# EAGLE design extruderControllerv01 (EAGLE 9.2.2)
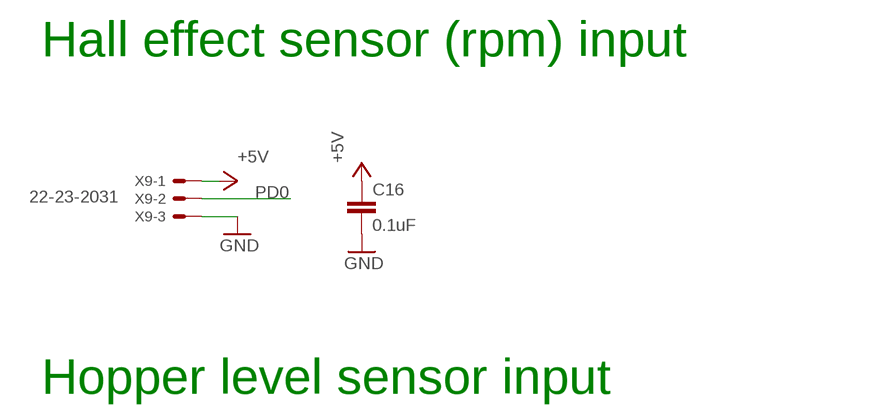
[diagram p0: schematic, sheet 1, part 1 of 3]
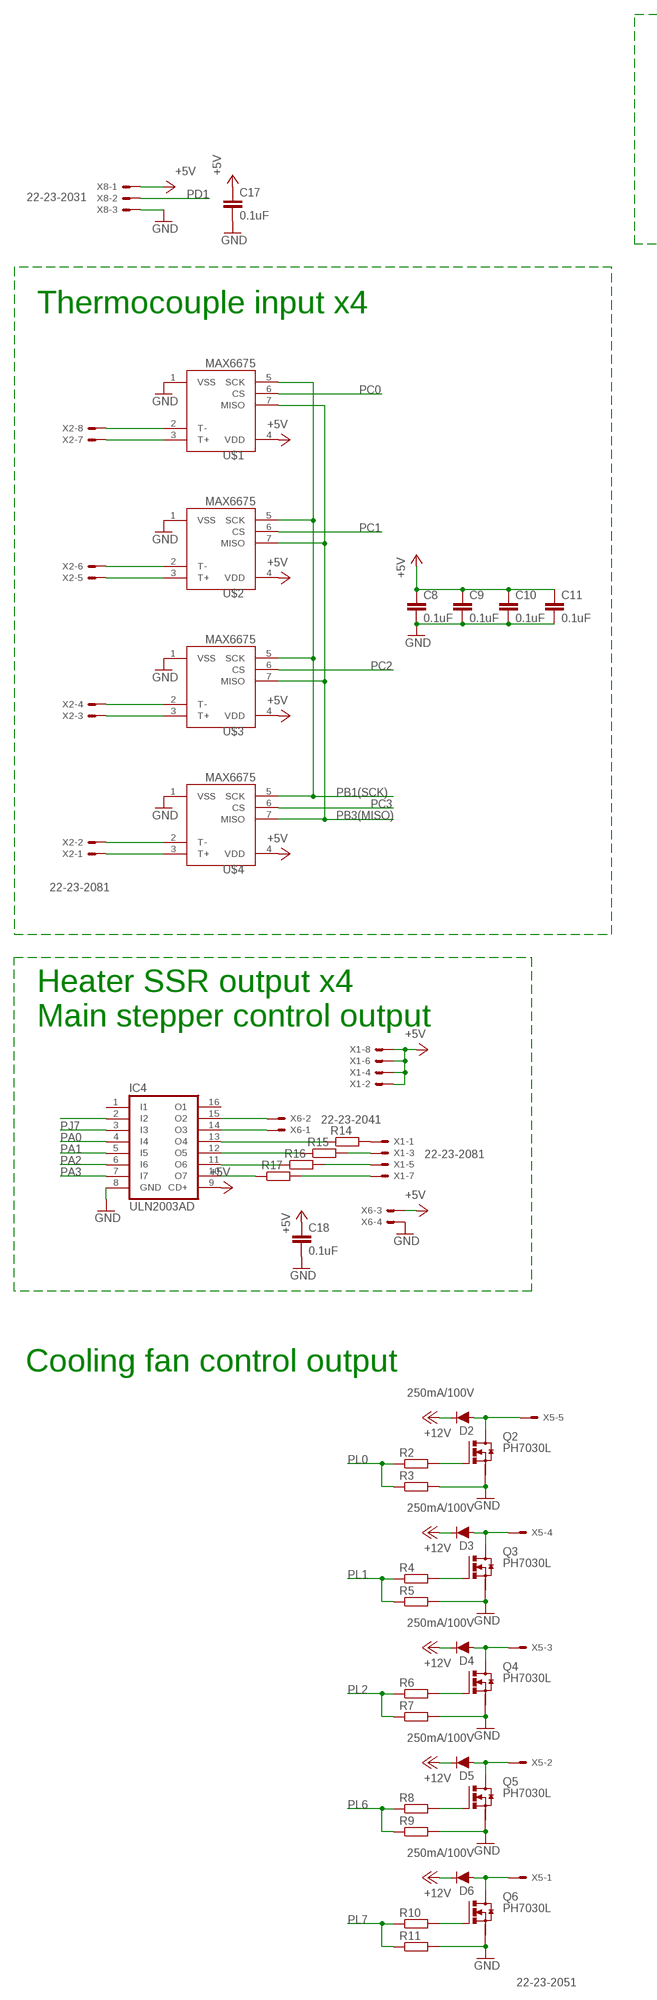
[diagram p1: schematic, sheet 1, part 2 of 3]
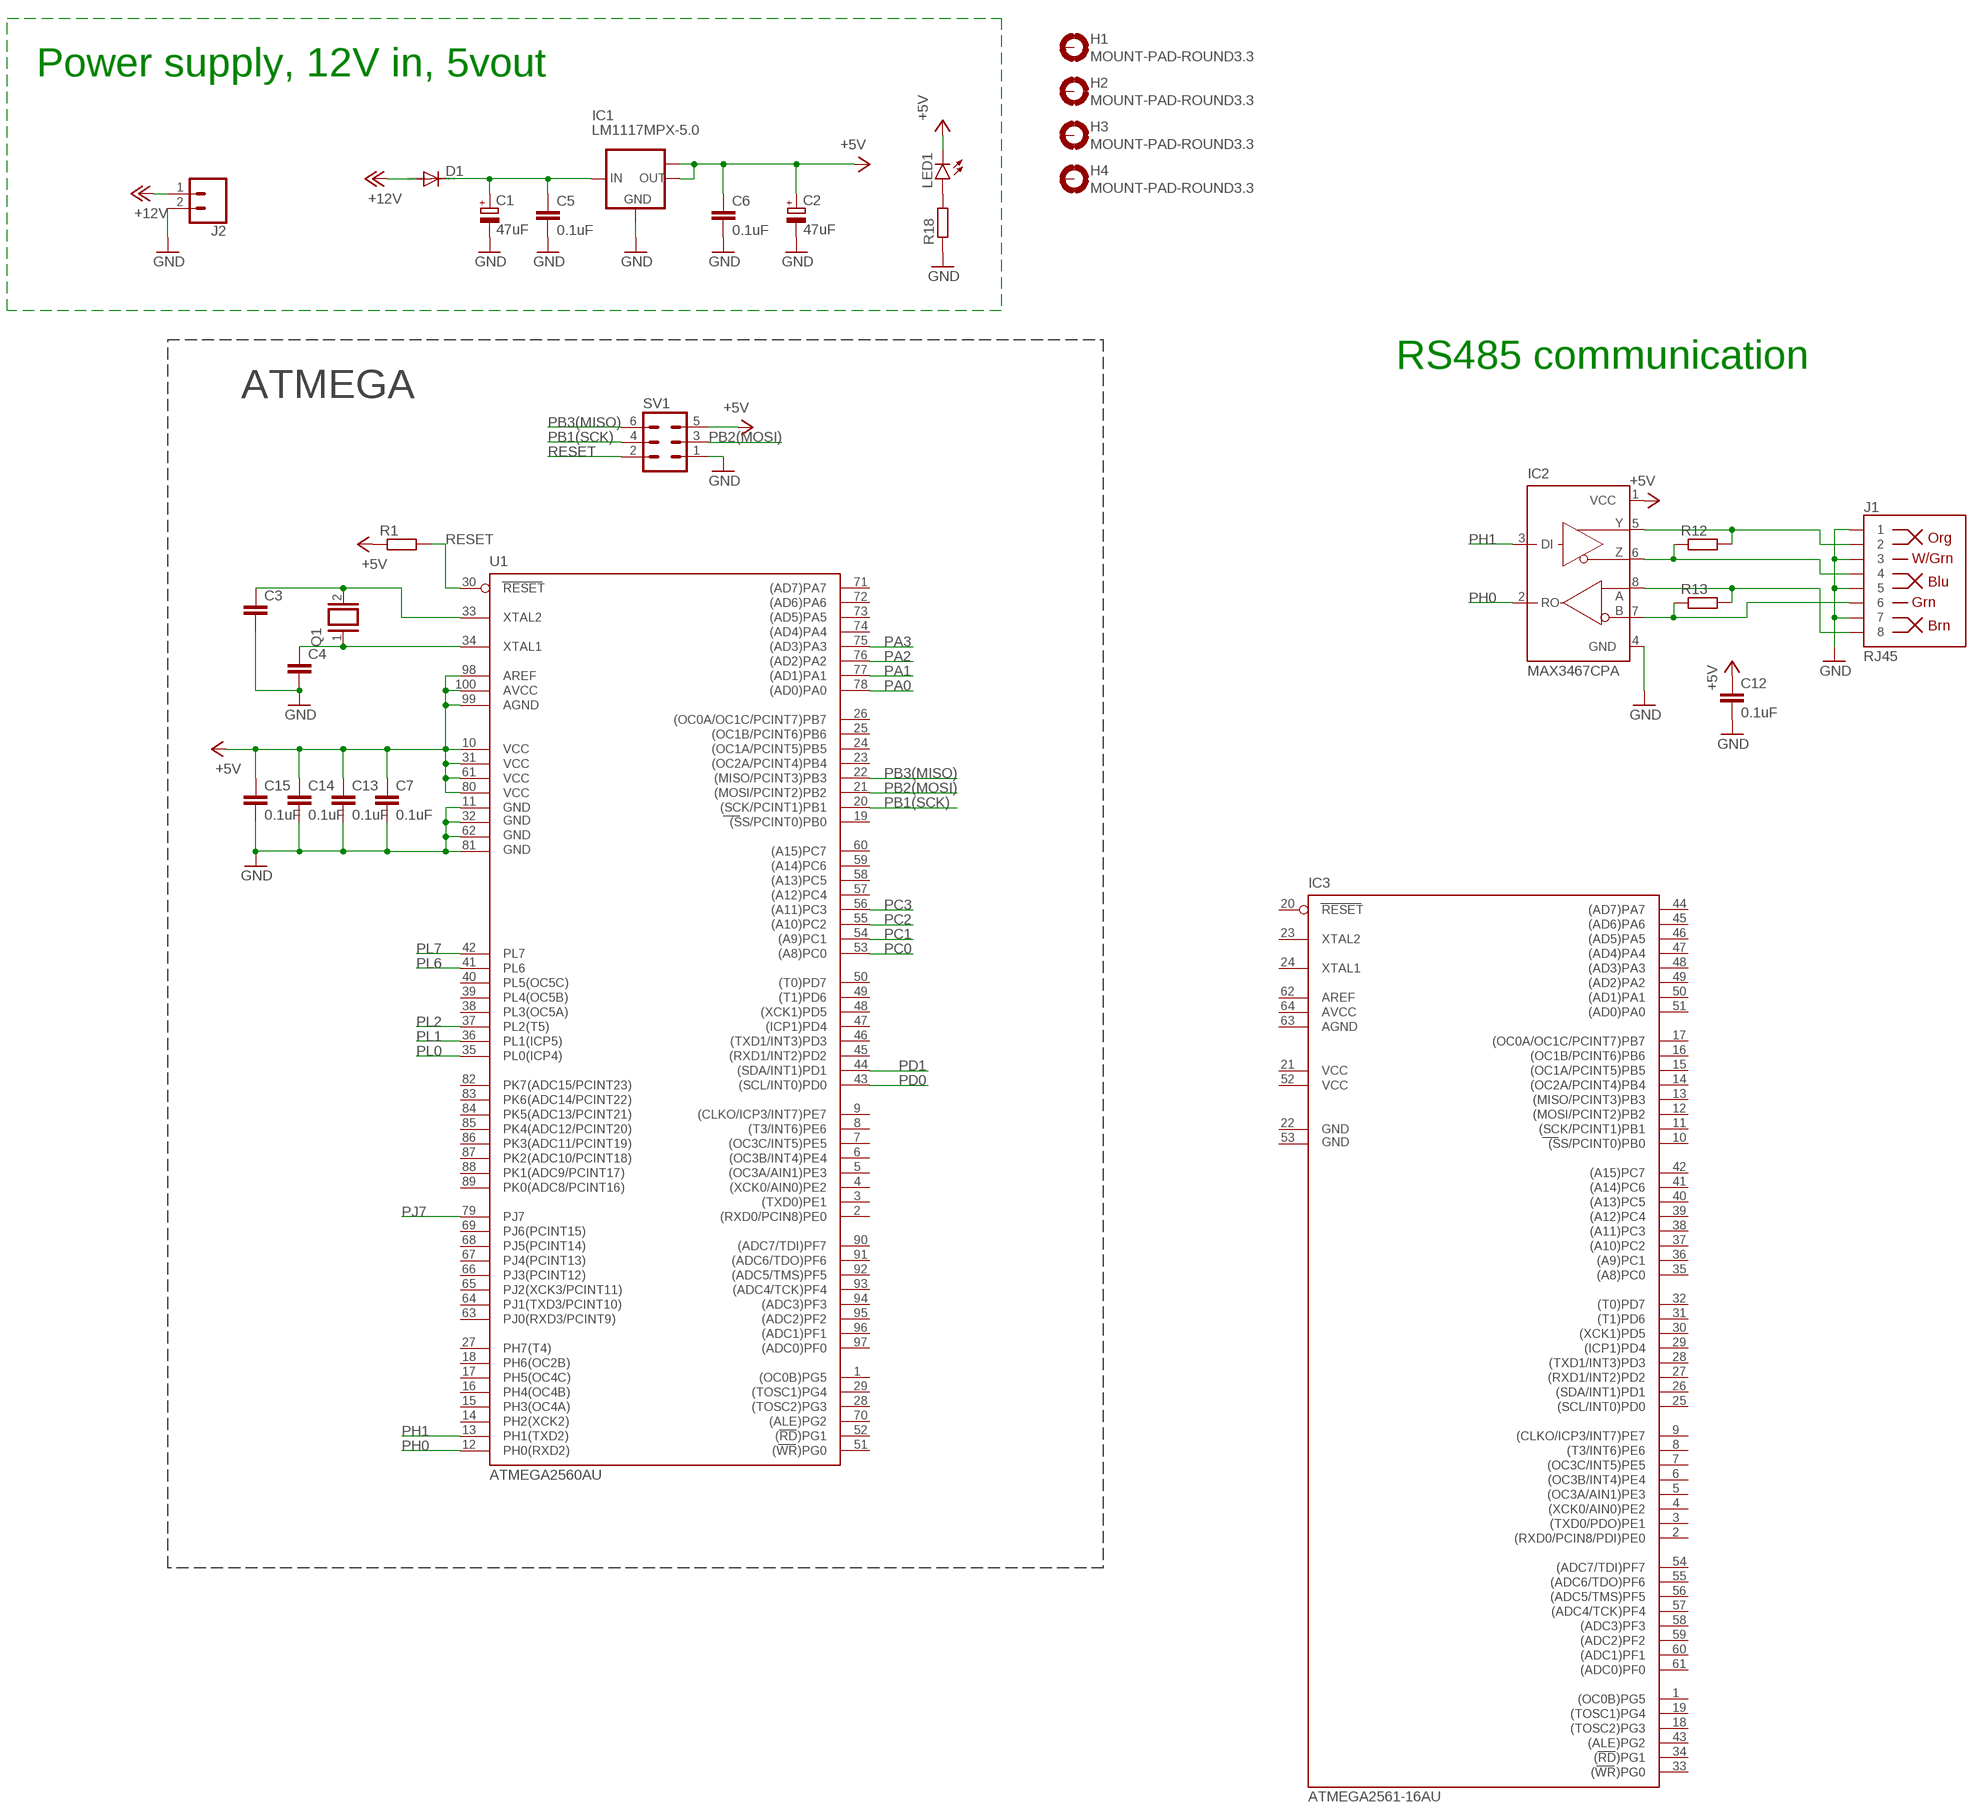
[diagram p2: schematic, sheet 1, part 3 of 3]

## Parts
C1  47uF  CPOL-EUD  [PANASONIC_D]
C2  47uF  CPOL-EUD  [PANASONIC_D]
C3  C-EUC0603  [C0603]
C4  C-EUC0603  [C0603]
C5  0.1uF  C-EUC0603  [C0603]
C6  0.1uF  C-EUC0603  [C0603]
C7  0.1uF  C-EUC0603  [C0603]
C8  0.1uF  C-EUC0603  [C0603]
C9  0.1uF  C-EUC0603  [C0603]
C10  0.1uF  C-EUC0603  [C0603]
C11  0.1uF  C-EUC0603  [C0603]
C12  0.1uF  C-EUC0603  [C0603]
C13  0.1uF  C-EUC0603  [C0603]
C14  0.1uF  C-EUC0603  [C0603]
C15  0.1uF  C-EUC0603  [C0603]
C16  0.1uF  C-EUC0603  [C0603]
C17  0.1uF  C-EUC0603  [C0603]
C18  0.1uF  C-EUC0603  [C0603]
D1  DIODE-SMB  [SMB]
D2  250mA/100V  DIODE-BAS16J  [SOD-323]
D3  250mA/100V  DIODE-BAS16J  [SOD-323]
D4  250mA/100V  DIODE-BAS16J  [SOD-323]
D5  250mA/100V  DIODE-BAS16J  [SOD-323]
D6  250mA/100V  DIODE-BAS16J  [SOD-323]
H1  MOUNT-PAD-ROUND3.3  [3,3-PAD]
H2  MOUNT-PAD-ROUND3.3  [3,3-PAD]
H3  MOUNT-PAD-ROUND3.3  [3,3-PAD]
H4  MOUNT-PAD-ROUND3.3  [3,3-PAD]
IC1  LM1117MPX-5.0  [SOT223]
IC2  MAX3467CPA  [SO08]
IC3  ATMEGA2561-16AU  [TQFP64]
IC4  ULN2003AD  [SO16]
J1  RJ45  RJ45-8  [RJ45-8]
J2  CONN_023.5MM  [SCREWTERMINAL-3.5MM-2]
LED1  LEDSML1206  [SML1206]
Q1  XTAL/S  [QS]
Q2  PH7030L  [SOT669]
Q3  PH7030L  [SOT669]
Q4  PH7030L  [SOT669]
Q5  PH7030L  [SOT669]
Q6  PH7030L  [SOT669]
R1  R-EU_R0805  [R0805]
R2  R-EU_R0805  [R0805]
R3  R-EU_R0805  [R0805]
R4  R-EU_R0805  [R0805]
R5  R-EU_R0805  [R0805]
R6  R-EU_R0805  [R0805]
R7  R-EU_R0805  [R0805]
R8  R-EU_R0805  [R0805]
R9  R-EU_R0805  [R0805]
R10  R-EU_R0805  [R0805]
R11  R-EU_R0805  [R0805]
R12  R-EU_R1210  [R1210]
R13  R-EU_R1210  [R1210]
R14  R-EU_R0805  [R0805]
R15  R-EU_R0805  [R0805]
R16  R-EU_R0805  [R0805]
R17  R-EU_R0805  [R0805]
R18  R-EU_R0805  [R0805]
SV1  MA03-2  [MA03-2]
U1  ATMEGA2560AU  [TQFP100]
U$1  MAX6675  [SO08-MAX6675]
U$2  MAX6675  [SO08-MAX6675]
U$3  MAX6675  [SO08-MAX6675]
U$4  MAX6675  [SO08-MAX6675]
X1  22-23-2081  [22-23-2081]
X2  22-23-2081  [22-23-2081]
X5  22-23-2051  [22-23-2051]
X6  22-23-2041  [22-23-2041]
X8  22-23-2031  [22-23-2031]
X9  22-23-2031  [22-23-2031]

## Nets
+5V: C2.+ C6.1 C7.1 C8.1 C9.1 C10.1 C11.1 C12.1 C13.1 C14.1 C15.1 C16.1 C17.1 C18.1 IC1.2(OUT) IC1.TAB(OUT1) IC2.1(VCC) IC4.9(CD+) LED1.C R1.1 SV1.5 U1.10(VCC) U1.31(VCC1) U1.61(VCC2) U1.80(VCC3) U1.98(AREF) U1.99(AGND) U1.100(AVCC) U$1.4(VDD) U$2.4(VDD) U$3.4(VDD) U$4.4(VDD) X1.2 X1.4 X1.6 X1.8 X6.3 X8.1 X9.1
+12V: D1.A D2.C D3.C D4.C D5.C D6.C J2.1
GND: C1.- C2.- C3.2 C4.2 C5.2 C6.2 C7.2 C8.2 C9.2 C10.2 C11.2 C12.2 C13.2 C14.2 C15.2 C16.2 C17.2 C18.2 IC1.1(GND) IC2.4(GND) IC4.8(GND) J1.1 J1.3 J1.5 J1.7 J2.2 Q2.1(S) Q3.1(S) Q4.1(S) Q5.1(S) Q6.1(S) R3.2 R5.2 R7.2 R9.2 R11.2 R18.1 SV1.1 U1.11(GND) U1.32(GND1) U1.62(GND2) U1.81(GND3) U$1.1(VSS) U$2.1(VSS) U$3.1(VSS) U$4.1(VSS) X6.4 X8.3 X9.3
N$2: Q2.4(G) R2.2
N$3: R14.2 X1.1
N$4: U$1.2(T-) X2.8
N$5: U$1.3(T+) X2.7
N$6: U$2.2(T-) X2.6
N$7: U$2.3(T+) X2.5
N$8: U$3.2(T-) X2.4
N$9: U$3.3(T+) X2.3
N$10: U$4.2(T-) X2.2
N$11: U$4.3(T+) X2.1
N$12: R15.2 X1.3
N$13: R16.2 X1.5
N$14: R17.2 X1.7
N$18: C1.+ C5.1 D1.C IC1.3(IN)
N$19: C3.1 Q1.2 U1.33(XTAL2)
N$20: C4.1 Q1.1 U1.34(XTAL1)
N$21: IC4.14(O3) X6.1
N$22: D2.A Q2.MB(D) X5.5
N$23: Q3.4(G) R4.2
N$24: IC4.15(O2) X6.2
N$25: D3.A Q3.MB(D) X5.4
N$26: Q4.4(G) R6.2
N$27: IC2.7(B) J1.6 R13.1
N$28: D4.A Q4.MB(D) X5.3
N$29: Q5.4(G) R8.2
N$30: IC4.13(O4) R14.1
N$31: D5.A Q5.MB(D) X5.2
N$32: Q6.4(G) R10.2
N$33: IC2.6(Z) J1.4 R12.1
N$34: D6.A Q6.MB(D) X5.1
N$35: IC2.5(Y) J1.2 R12.2
N$36: IC2.8(A) J1.8 R13.2
N$37: IC4.2(I2)
N$38: IC4.12(O5) R15.1
N$39: IC4.11(O6) R16.1
N$40: IC4.10(O7) R17.1
N$41: LED1.A R18.2
PA0: IC4.4(I4) U1.78((AD0)PA0)
PA1: IC4.5(I5) U1.77((AD1)PA1)
PA2: IC4.6(I6) U1.76((AD2)PA2)
PA3: IC4.7(I7) U1.75((AD3)PA3)
PB1(SCK): SV1.4 U1.20((SCK/PCINT1)PB1) U$1.5(SCK) U$2.5(SCK) U$3.5(SCK) U$4.5(SCK)
PB2(MOSI): SV1.3 U1.21((MOSI/PCINT2)PB2)
PB3(MISO): SV1.6 U1.22((MISO/PCINT3)PB3) U$1.7(MISO) U$2.7(MISO) U$3.7(MISO) U$4.7(MISO)
PC0: U1.53((A8)PC0) U$1.6(CS)
PC1: U1.54((A9)PC1) U$2.6(CS)
PC2: U1.55((A10)PC2) U$3.6(CS)
PC3: U1.56((A11)PC3) U$4.6(CS)
PD0: U1.43((SCL/INT0)PD0) X9.2
PD1: U1.44((SDA/INT1)PD1) X8.2
PH0: IC2.2(RO) U1.12(PH0(RXD2))
PH1: IC2.3(DI) U1.13(PH1(TXD2))
PJ7: IC4.3(I3) U1.79(PJ7)
PL0: R2.1 R3.1 U1.35(PL0(ICP4))
PL1: R4.1 R5.1 U1.36(PL1(ICP5))
PL2: R6.1 R7.1 U1.37(PL2(T5))
PL6: R8.1 R9.1 U1.41(PL6)
PL7: R10.1 R11.1 U1.42(PL7)
RESET: R1.2 SV1.2 U1.30(RESET)
Unconnected: H1.B3,3(MOUNT) H2.B3,3(MOUNT) H3.B3,3(MOUNT) H4.B3,3(MOUNT) IC3.1((OC0B)PG5) IC3.2((RXD0/PCIN8/PDI)PE0) IC3.3((TXD0/PDO)PE1) IC3.4((XCK0/AIN0)PE2) IC3.5((OC3A/AIN1)PE3) IC3.6((OC3B/INT4)PE4) IC3.7((OC3C/INT5)PE5) IC3.8((T3/INT6)PE6) IC3.9((CLKO/ICP3/INT7)PE7) IC3.10((SS/PCINT0)PB0) IC3.11((SCK/PCINT1)PB1) IC3.12((MOSI/PCINT2)PB2) IC3.13((MISO/PCINT3)PB3) IC3.14((OC2A/PCINT4)PB4) IC3.15((OC1A/PCINT5)PB5) IC3.16((OC1B/PCINT6)PB6) IC3.17((OC0A/OC1C/PCINT7)PB7) IC3.18((TOSC2)PG3) IC3.19((TOSC1)PG4) IC3.20(RESET) IC3.23(XTAL2) IC3.24(XTAL1) IC3.25((SCL/INT0)PD0) IC3.26((SDA/INT1)PD1) IC3.27((RXD1/INT2)PD2) IC3.28((TXD1/INT3)PD3) IC3.29((ICP1)PD4) IC3.30((XCK1)PD5) IC3.31((T1)PD6) IC3.32((T0)PD7) IC3.33((WR)PG0) IC3.34((RD)PG1) IC3.35((A8)PC0) IC3.36((A9)PC1) IC3.37((A10)PC2) IC3.38((A11)PC3) IC3.39((A12)PC4) IC3.40((A13)PC5) IC3.41((A14)PC6) IC3.42((A15)PC7) IC3.43((ALE)PG2) IC3.44((AD7)PA7) IC3.45((AD6)PA6) IC3.46((AD5)PA5) IC3.47((AD4)PA4) IC3.48((AD3)PA3) IC3.49((AD2)PA2) IC3.50((AD1)PA1) IC3.51((AD0)PA0) IC3.54((ADC7/TDI)PF7) IC3.55((ADC6/TDO)PF6) IC3.56((ADC5/TMS)PF5) IC3.57((ADC4/TCK)PF4) IC3.58((ADC3)PF3) IC3.59((ADC2)PF2) IC3.60((ADC1)PF1) IC3.61((ADC0)PF0) IC3.62(AREF) IC4.1(I1) IC4.16(O1) Q2.2(S) Q2.3(S) Q3.2(S) Q3.3(S) Q4.2(S) Q4.3(S) Q5.2(S) Q5.3(S) Q6.2(S) Q6.3(S) U1.1((OC0B)PG5) U1.2((RXD0/PCIN8)PE0) U1.3((TXD0)PE1) U1.4((XCK0/AIN0)PE2) U1.5((OC3A/AIN1)PE3) U1.6((OC3B/INT4)PE4) U1.7((OC3C/INT5)PE5) U1.8((T3/INT6)PE6) U1.9((CLKO/ICP3/INT7)PE7) U1.14(PH2(XCK2)) U1.15(PH3(OC4A)) U1.16(PH4(OC4B)) U1.17(PH5(OC4C)) U1.18(PH6(OC2B)) U1.19((SS/PCINT0)PB0) U1.23((OC2A/PCINT4)PB4) U1.24((OC1A/PCINT5)PB5) U1.25((OC1B/PCINT6)PB6) U1.26((OC0A/OC1C/PCINT7)PB7) U1.27(PH7(T4)) U1.28((TOSC2)PG3) U1.29((TOSC1)PG4) U1.38(PL3(OC5A)) U1.39(PL4(OC5B)) U1.40(PL5(OC5C)) U1.45((RXD1/INT2)PD2) U1.46((TXD1/INT3)PD3) U1.47((ICP1)PD4) U1.48((XCK1)PD5) U1.49((T1)PD6) U1.50((T0)PD7) U1.51((WR)PG0) U1.52((RD)PG1) U1.57((A12)PC4) U1.58((A13)PC5) U1.59((A14)PC6) U1.60((A15)PC7) U1.63(PJ0(RXD3/PCINT9)) U1.64(PJ1(TXD3/PCINT10)) U1.65(PJ2(XCK3/PCINT11)) U1.66(PJ3(PCINT12)) U1.67(PJ4(PCINT13)) U1.68(PJ5(PCINT14)) U1.69(PJ6(PCINT15)) U1.70((ALE)PG2) U1.71((AD7)PA7) U1.72((AD6)PA6) U1.73((AD5)PA5) U1.74((AD4)PA4) U1.82(PK7(ADC15/PCINT23)) U1.83(PK6(ADC14/PCINT22)) U1.84(PK5(ADC13/PCINT21)) U1.85(PK4(ADC12/PCINT20)) U1.86(PK3(ADC11/PCINT19)) U1.87(PK2(ADC10/PCINT18)) U1.88(PK1(ADC9/PCINT17)) U1.89(PK0(ADC8/PCINT16)) U1.90((ADC7/TDI)PF7) U1.91((ADC6/TDO)PF6) U1.92((ADC5/TMS)PF5) U1.93((ADC4/TCK)PF4) U1.94((ADC3)PF3) U1.95((ADC2)PF2) U1.96((ADC1)PF1) U1.97((ADC0)PF0)

## Notes on the sheet
- Hall effect sensor (rpm) input
- Hopper level sensor input
- Power supply, 12V in, 5vout
- RS485 communication
- Thermocouple input x4 | ATMEGA
- Heater SSR output x4
- Main stepper control output
- Cooling fan control output

## Power pins joined to a net without a drawn wire
AGND: IC3.63(AGND)
AVCC: IC3.64(AVCC)
GND: IC3.22(GND)
GND1: IC3.53(GND1)
VCC: IC3.21(VCC)
VCC1: IC3.52(VCC1)

## Library data of the parts
C1 C2 = rcl:CPOL-EU: POLARIZED CAPACITOR, European symbol; SPICEPREFIX: C
C3-C18 = rcl:C-EU: CAPACITOR, European symbol; SPICEPREFIX: C
D1 = diode:DIODE-: DIODE
D2-D6 = SparkFun-DiscreteSemi:DIODE: Diode These are standard reverse protection diodes and small signal diodes. SparkFun Products: SparkFun SparkPunk Sound Kit <https://www.sparkfun.com/products/11177> SparkFun ESP8266 Thing <https://www.sparkfun.com/products/13231>; PROD_ID: DIO-09646
H1-H4 = holes:MOUNT-PAD-ROUND: MOUNTING PAD, round
IC1 = lm1117:LM1117MPX-*
IC2 = maxim:MAX3467*: +5V, Fail-Safe, 40Mbps, Profibus RS-485/RS-422 Transceivers Source: MAX3465-MAX3469.pdf; OC_FARNELL: unknown; OC_NEWARK: unknown
IC3 = atmel-2005:ATMEGA2561*: MICROCONTROLLER 256 Kbytes FLASH 4 Kbytes EEPROM 8 Kbytes SRAM 54 General Purpose I/O pins 6-channels 16-bit PWM 2 x Serial USARTs 8-channels 10-bit A/D
IC4 = uln-udn:ULN2003A: DRIVER ARRAY
J1 = SparkFun-Connectors:RJ45-8: RJ45 Jack - 8 pin Simple RJ45, 8-pin connection. Commonly used for Cat5, Cat5e, and Cat6 Ethernet cables. Here is the connector we sell at SparkFun: RJ45 8-Pin Connector <https://www.sparkfun.com/products/643> (PRT-00643) Datasheet <https://cdn.sparkfun.com/datasheets/Prototyping/04908.pdf> It is used on this SparkFun product: SparkFun RJ45 Breakout <https://www.sparkfun.com/products/716> (BOB-00716) Note, you may also be interested in the "MAGJACK" version of this. It is basically a RJ45 connector, but also has some status LEDs built into the connector housing. You can check that out in this library at the device named "MAGJACK.dev" and see these products online: RJ45 Ethernet MagJack-Compatible <https://www.sparkfun.com/products/8534> (PRT-08534) SparkFun RJ45 MagJack Breakout <https://www.sparkfun.com/products/13021> (BOB-13021); PROD_ID: CONN-08506; SF_ID: PRT-00643
J2 = SparkFun-Connectors:CONN_02: Multi connection point. Often used as Generic Header-pin footprint for 0.1 inch spaced/style header connections On any of the 0.1 inch spaced packages, you can populate with these: Break Away Headers - Straight <https://www.sparkfun.com/products/116> (PRT-00116) Break Away Male Headers - Right Angle <https://www.sparkfun.com/products/553> (PRT-00553) Female Headers <https://www.sparkfun.com/products/115> (PRT-00115) Break Away Headers - Machine Pin <https://www.sparkfun.com/products/117> (PRT-00117) Break Away Female Headers - Swiss Machine Pin <https://www.sparkfun.com/products/743> (PRT-00743) For SCREWTERMINALS and SPRING TERMINALS visit here: Screw Terimnals on SparkFun.com <https://www.sparkfun.com/search/results?term=Screw+Terminals> (5mm/3.5mm/2.54mm spacing) This device is also useful as a general connection point to wire up your design to another part of your project. Our various solder wires solder well into these plated through hole pads. Hook-Up Wire - Assortment (Stranded, 22 AWG) <https://www.sparkfun.com/products/11375> (PRT-11375) Hook-Up Wire - Assortment (Solid Core, 22 AWG) <https://www.sparkfun.com/products/11367> (PRT-11367) View the entire wire category on our website here <https://www.sparkfun.com/categories/141> Special notes: Molex polarized connector foot print use with: PRT-08233 with associated crimp pins and housings. 2.54_SCREWTERM for use with PRT-10571. 3.5mm Screw Terminal footprints for PRT-08084 5mm Screw Terminal footprints for use with PRT-08432; PROD_ID: CONN-08399
LED1 = led:LED: LED OSRAM: - CHIPLED LG R971, LG N971, LY N971, LG Q971, LY Q971, LO R971, LY R971 LH N974, LH R974 LS Q976, LO Q976, LY Q976 LO Q996 - Hyper CHIPLED LW Q18S LB Q993, LB Q99A, LB R99A - SideLED LS A670, LO A670, LY A670, LG A670, LP A670 LB A673, LV A673, LT A673, LW A673 LH A674 LY A675 LS A676, LA A676, LO A676, LY A676, LW A676 LS A679, LY A679, LG A679 - Hyper Micro SIDELED® LS Y876, LA Y876, LO Y876, LY Y876 LT Y87S - SmartLED LW L88C, LW L88S LB L89C, LB L89S, LG L890 LS L89K, LO L89K, LY L89K LS L896, LA L896, LO L896, LY L896 - TOPLED LS T670, LO T670, LY T670, LG T670, LP T670 LSG T670, LSP T670, LSY T670, LOP T670, LYG T670 LG T671, LOG T671, LSG T671 LB T673, LV T673, LT T673, LW T673 LH T674 LS T676, LA T676, LO T676, LY T676, LB T676, LH T676, LSB T676, LW T676 LB T67C, LV T67C, LT T67C, LS T67K, LO T67K, LY T67K, LW E67C LS E67B, LA E67B, LO E67B, LY E67B, LB E67C, LV E67C, LT E67C LW T67C LS T679, LY T679, LG T679 LS T770, LO T770, LY T770, LG T770, LP T770 LB T773, LV T773, LT T773, LW T773 LH T774 LS E675, LA E675, LY E675, LS T675 LS T776, LA T776, LO T776, LY T776, LB T776 LHGB T686 LT T68C, LB T68C - Hyper Mini TOPLED® LB M676 - Mini TOPLED Santana® LG M470 LS M47K, LO M47K, LY M47K Source: http://www.osram.convergy.de LUXEON: - LUMILED® LXK2-PW12-R00, LXK2-PW12-S00, LXK2-PW14-U00, LXK2-PW14-V00 LXK2-PM12-R00, LXK2-PM12-S00, LXK2-PM14-U00 LXK2-PE12-Q00, LXK2-PE12-R00, LXK2-PE12-S00, LXK2-PE14-T00, LXK2-PE14-U00 LXK2-PB12-K00, LXK2-PB12-L00, LXK2-PB12-M00, LXK2-PB14-N00, LXK2-PB14-P00, LXK2-PB14-Q00 LXK2-PR12-L00, LXK2-PR12-M00, LXK2-PR14-Q00, LXK2-PR14-R00 LXK2-PD12-Q00, LXK2-PD12-R00, LXK2-PD12-S00 LXK2-PH12-R00, LXK2-PH12-S00 LXK2-PL12-P00, LXK2-PL12-Q00, LXK2-PL12-R00 Source: www.luxeon.com KINGBRIGHT: KA-3528ASYC Source: www.kingbright.com
Q1 = special:XTAL/S: CRYSTAL
Q2-Q6 = transistor-power:PH7030L: N-channel TrenchMOS (TM) logic level FET Source: http://www.nxp.com/acrobat_download/datasheets/PH7030L_4.pdf
R1-R18 = rcl:R-EU_: RESISTOR, European symbol; SPICEPREFIX: R
SV1 = con-lstb:MA03-2: PIN HEADER; OC_FARNELL: unknown; OC_NEWARK: unknown
U1 = SparkFun-IC-Microcontroller:ATMEGA2560: Atmel 100-pin 8-bit uC 64/128/256 Kbytes FLASH 4 Kbytes EEPROM 8 Kbytes SRAM 86 General Purpose I/O pins 12-channels16-bit PWM 4 x Serial USARTs 16-channels 10-bit A/D SparkFun Products None.; PROD_ID: IC-10040
U$1-U$4 = SparkFun-AnalogIC:MAX6675: K-type thermocouple ADC, SPI output
X1 X2 = con-molex:22-23-2081: .100" (2.54mm) Center Header - 8 Pin; MF: MOLEX; MPN: 22-23-2081; OC_FARNELL: 1756826; OC_NEWARK: 01C7592
X5 = con-molex:22-23-2051: .100" (2.54mm) Center Header - 5 Pin; MF: MOLEX; MPN: 22-23-2051; OC_FARNELL: 1462952; OC_NEWARK: 38C9178
X6 = con-molex:22-23-2041: .100" (2.54mm) Center Header - 4 Pin; MF: MOLEX; MPN: 22-23-2041; OC_FARNELL: 1462920; OC_NEWARK: 38C0355
X8 X9 = con-molex:22-23-2031: .100" (2.54mm) Center Header - 3 Pin; MF: MOLEX; MPN: 22-23-2031; OC_FARNELL: 1462950; OC_NEWARK: 30C0862

## Board
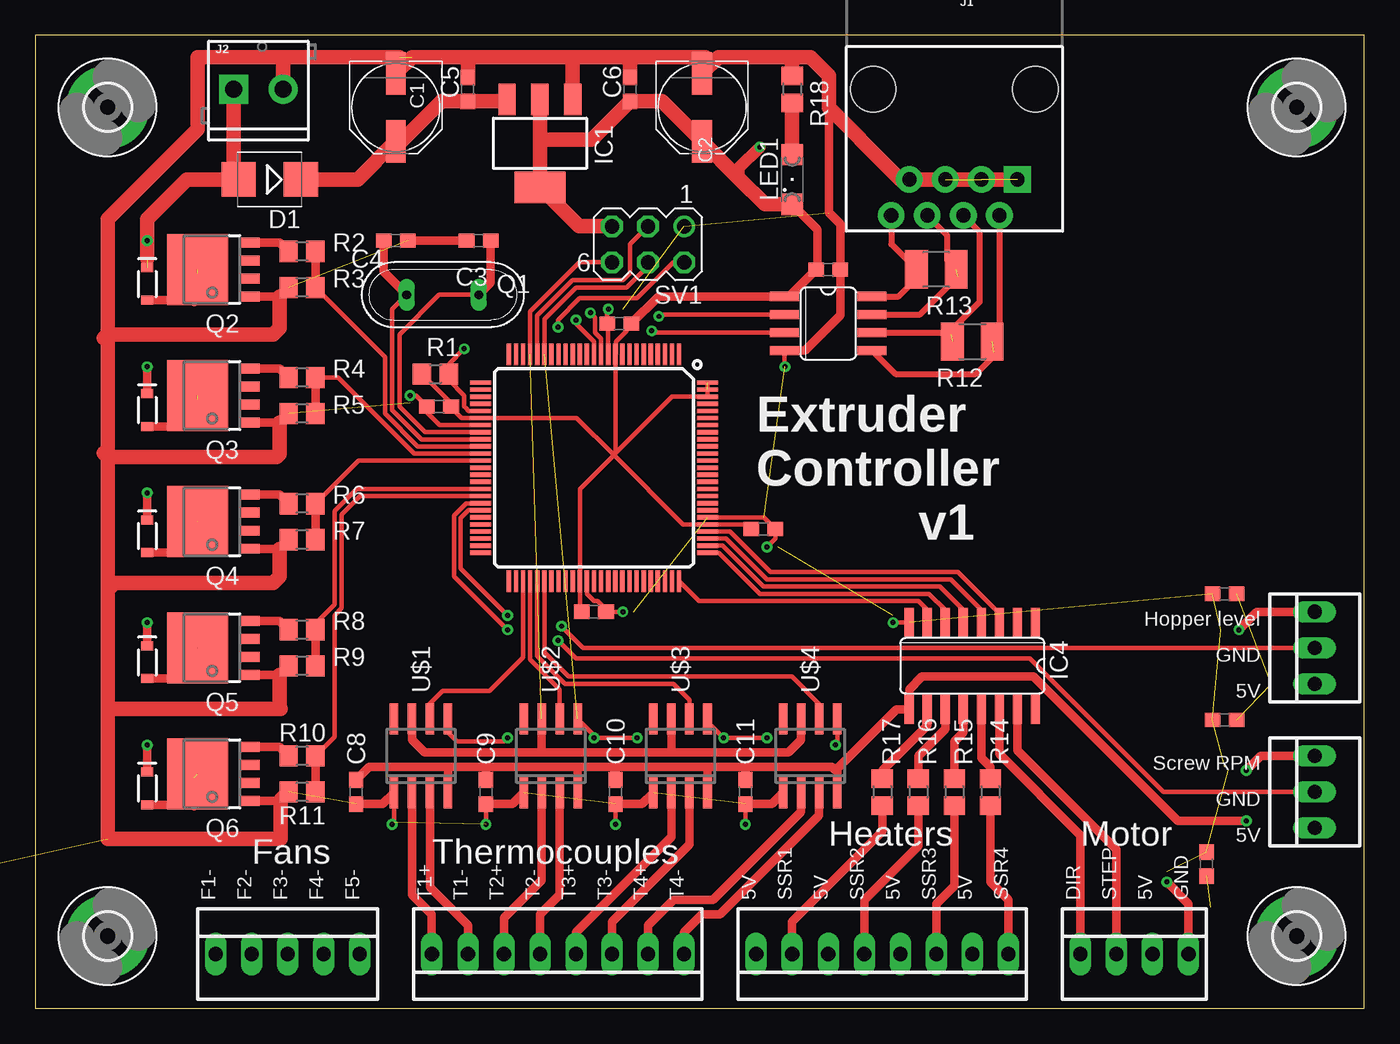
[diagram p3: board, top side]
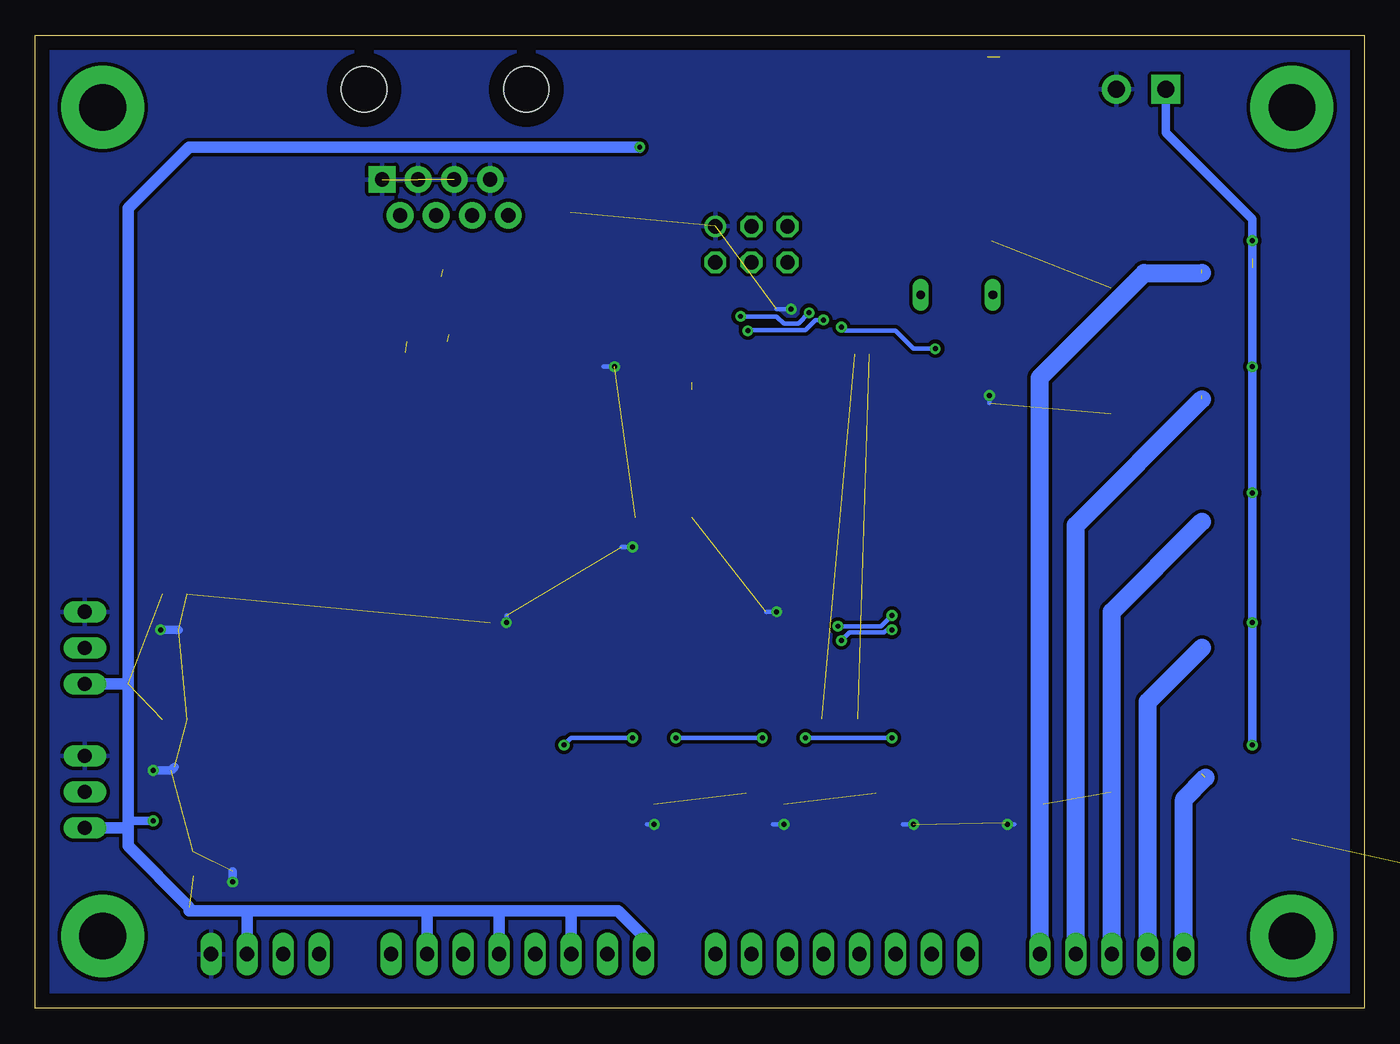
[diagram p4: board, bottom side, seen from below]

Size 93.65 x 68.57 mm. Coordinates in mm from the lower left corner, seen from the top.
Outline: 0,0 93.65,0 93.65,68.57 0,68.57 0,0
Copper layers (1*16): Top 0.035mm / dielectric 1.5mm / Bottom 0.035mm
Design rules "default": minimum track width 6mil, minimum drill 0.35mm, track to track 6mil, track to pad 6mil, pad to pad 6mil, via to via 6mil, smd to smd 6mil, copper to edge 40mil, drill to drill 6mil, minimum pad ring 10mil, minimum via ring 8mil, stop-mask expansion 4mil, vias tented up to drill 0mil, thermal gap 10mil

### Footprints (pad centres in the part's own frame; a part is rotated, then mirrored left to right if it is on the bottom)
PANASONIC_D = smd 3 x 1.4: + 2.4,0; - -2.4,0
C0603 = smd 1.1 x 1: 1 -0.85,0; 2 0.85,0
SMB = smd 2.4 x 2.4: A 2.2,0; C -2.2,0
SOD-323 = smd 0.63 x 0.83: A 1.15,0; C -1.15,0
3,3-PAD = drill 3.3 pad 5.842: B3,3 0,0
SOT223 = smd 1.219 x 2.235: 1 -2.311,-3.099; 2 0,-3.099; 3 2.311,-3.099 | smd 3.6 x 2.2: TAB 0,3.099
SO08 = smd 0.66 x 2.032: 1 -1.905,-3.073; 2 -0.635,-3.073; 3 0.635,-3.073; 4 1.905,-3.073; 5 1.905,3.073; 6 0.635,3.073; 7 -0.635,3.073; 8 -1.905,3.073
TQFP64 = smd 1.194 x 0.559: 1 -7.76,5.905; 2 -7.76,5.118; 3 -7.76,4.331; 4 -7.76,3.543; 5 -7.76,2.756; 6 -7.76,1.968; 7 -7.76,1.181; 8 -7.76,0.394; 9 -7.76,-0.394; 10 -7.76,-1.181; 11 -7.76,-1.968; 12 -7.76,-2.756; 13 -7.76,-3.543; 14 -7.76,-4.331; 15 -7.76,-5.118; 16 -7.76,-5.905; 33 7.76,-5.905; 34 7.76,-5.118; 35 7.76,-4.331; 36 7.76,-3.543; 37 7.76,-2.756; 38 7.76,-1.968; 39 7.76,-1.181; 40 7.76,-0.394; 41 7.76,0.394; 42 7.76,1.181; 43 7.76,1.968; 44 7.76,2.756; 45 7.76,3.543; 46 7.76,4.331; 47 7.76,5.118; 48 7.76,5.905 | smd 0.559 x 1.194: 17 -5.905,-7.76; 18 -5.118,-7.76; 19 -4.331,-7.76; 20 -3.543,-7.76; 21 -2.756,-7.76; 22 -1.968,-7.76; 23 -1.181,-7.76; 24 -0.394,-7.76; 25 0.394,-7.76; 26 1.181,-7.76; 27 1.968,-7.76; 28 2.756,-7.76; 29 3.543,-7.76; 30 4.331,-7.76; 31 5.118,-7.76; 32 5.905,-7.76; 49 5.905,7.76; 50 5.118,7.76; 51 4.331,7.76; 52 3.543,7.76; 53 2.756,7.76; 54 1.968,7.76; 55 1.181,7.76; 56 0.394,7.76; 57 -0.394,7.76; 58 -1.181,7.76; 59 -1.968,7.76; 60 -2.756,7.76; 61 -3.543,7.76; 62 -4.331,7.76; 63 -5.118,7.76; 64 -5.905,7.76
SO16 = smd 0.66 x 2.032: 1 -4.445,-3.073; 2 -3.175,-3.073; 3 -1.905,-3.073; 4 -0.635,-3.073; 5 0.635,-3.073; 6 1.905,-3.073; 7 3.175,-3.073; 8 4.445,-3.073; 9 4.445,3.073; 10 3.175,3.073; 11 1.905,3.073; 12 0.635,3.073; 13 -0.635,3.073; 14 -1.905,3.073; 15 -3.175,3.073; 16 -4.445,3.073
RJ45-8 = drill 1 pad 1.88 square: 1 -4.445,6.35 | drill 1 pad 1.88: 2 -3.175,8.89; 3 -1.905,6.35; 4 -0.635,8.89; 5 0.635,6.35; 6 1.905,8.89; 7 3.175,6.35; 8 4.445,8.89 | hole 3.2: -5.715,0; 5.715,0
SCREWTERMINAL-3.5MM-2 = drill 1.2 pad 2.032 square: 1 0,0 | drill 1.2 pad 2.032: 2 3.5,0
SML1206 = smd 1.5 x 1.5: A 1.75,0; C -1.75,0
QS = drill 0.61 long: 1 -2.54,0; 2 2.54,0
SOT669 = smd 0.7 x 1.4: 1 -1.905,-2.65; 2 -0.635,-2.65; 3 0.635,-2.65; 4 1.905,-2.65 | smd 5 x 4.3: MB 0,1
R0805 = smd 1.3 x 1.5: 1 -0.95,0; 2 0.95,0
R1210 = smd 1.6 x 2.7: 1 -1.4,0; 2 1.4,0
MA03-2 = drill 1.016: 1 -2.54,-1.27 | drill 1.016 octagon: 2 -2.54,1.27; 3 0,-1.27; 4 0,1.27; 5 2.54,-1.27; 6 2.54,1.27
TQFP100 = smd 1.5 x 0.3: 1 -8,6; 2 -8,5.5; 3 -8,5; 4 -8,4.5; 5 -8,4; 6 -8,3.5; 7 -8,3; 8 -8,2.5; 9 -8,2; 10 -8,1.5; 11 -8,1; 12 -8,0.5; 13 -8,0; 14 -8,-0.5; 15 -8,-1; 16 -8,-1.5; 17 -8,-2; 18 -8,-2.5; 19 -8,-3; 20 -8,-3.5; 21 -8,-4; 22 -8,-4.5; 23 -8,-5; 24 -8,-5.5; 25 -8,-6; 51 8,-6; 52 8,-5.5; 53 8,-5; 54 8,-4.5; 55 8,-4; 56 8,-3.5; 57 8,-3; 58 8,-2.5; 59 8,-2; 60 8,-1.5; 61 8,-1; 62 8,-0.5; 63 8,0; 64 8,0.5; 65 8,1; 66 8,1.5; 67 8,2; 68 8,2.5; 69 8,3; 70 8,3.5; 71 8,4; 72 8,4.5; 73 8,5; 74 8,5.5; 75 8,6 | smd 0.3 x 1.5: 26 -6,-8; 27 -5.5,-8; 28 -5,-8; 29 -4.5,-8; 30 -4,-8; 31 -3.5,-8; 32 -3,-8; 33 -2.5,-8; 34 -2,-8; 35 -1.5,-8; 36 -1,-8; 37 -0.5,-8; 38 0,-8; 39 0.5,-8; 40 1,-8; 41 1.5,-8; 42 2,-8; 43 2.5,-8; 44 3,-8; 45 3.5,-8; 46 4,-8; 47 4.5,-8; 48 5,-8; 49 5.5,-8; 50 6,-8; 76 6,8; 77 5.5,8; 78 5,8; 79 4.5,8; 80 4,8; 81 3.5,8; 82 3,8; 83 2.5,8; 84 2,8; 85 1.5,8; 86 1,8; 87 0.5,8; 88 0,8; 89 -0.5,8; 90 -1,8; 91 -1.5,8; 92 -2,8; 93 -2.5,8; 94 -3,8; 95 -3.5,8; 96 -4,8; 97 -4.5,8; 98 -5,8; 99 -5.5,8; 100 -6,8
SO08-MAX6675 = smd 0.6 x 2.2: 1 -1.905,-2.6; 2 -0.635,-2.6; 3 0.635,-2.6; 4 1.905,-2.6; 5 1.905,2.6; 6 0.635,2.6; 7 -0.635,2.6; 8 -1.905,2.6
22-23-2081 = drill 1 long: 1 -8.89,0; 2 -6.35,0; 3 -3.81,0; 4 -1.27,0; 5 1.27,0; 6 3.81,0; 7 6.35,0; 8 8.89,0
22-23-2051 = drill 1 long: 1 -5.08,0; 2 -2.54,0; 3 0,0; 4 2.54,0; 5 5.08,0
22-23-2041 = drill 1 long: 1 -3.81,0; 2 -1.27,0; 3 1.27,0; 4 3.81,0
22-23-2031 = drill 1 long: 1 -2.54,0; 2 0,0; 3 2.54,0

### Placement (x,y rotation side)
C1  25.4,63.5 270 top
C2  46.99,63.5 270 top
C3  31.24,54.1 180 top
C4  25.4,54.1 0 top
C5  30.48,64.77 90 top
C6  41.91,64.77 90 top
C7  41.15,48.26 180 top
C8  22.61,15.24 270 top
C9  31.75,15.24 270 top
C10  40.89,15.24 270 top
C11  50.04,15.24 270 top
C12  55.88,52.07 0 top
C13  39.37,27.94 0 top
C14  28.45,42.42 180 top
C15  51.31,33.78 0 top
C16  83.82,29.21 180 top
C17  83.82,20.32 180 top
C18  82.55,10.16 90 top
D1  16.51,58.42 180 top
D2  7.87,51.05 270 top
D3  7.87,42.16 270 top
D4  7.87,33.27 270 top
D5  7.87,24.38 270 top
D6  7.87,15.49 270 top
H1  5.08,63.5 0 top
H2  5.08,5.08 0 top
H3  88.9,5.08 0 top
H4  88.9,63.5 0 top
IC1  35.56,60.96 180 top
IC2  55.88,48.26 270 top
IC3  -43.69,8.38 0 top  (outside the outline)
IC4  66.04,24.13 180 top
J1  64.77,64.77 180 top
J2  13.97,64.77 0 top
LED1  53.34,58.42 90 top
Q1  28.7,50.29 0 top
Q2  12.45,52.07 90 top
Q3  12.45,43.18 90 top
Q4  12.45,34.29 90 top
Q5  12.45,25.4 90 top
Q6  12.45,16.51 90 top
R1  28.19,44.7 0 top
R2  18.8,53.34 180 top
R3  18.8,50.8 180 top
R4  18.8,44.45 180 top
R5  18.8,41.91 180 top
R6  18.8,35.56 180 top
R7  18.8,33.02 180 top
R8  18.8,26.67 180 top
R9  18.8,24.13 180 top
R10  18.8,17.78 180 top
R11  18.8,15.24 180 top
R12  66.04,46.99 0 top
R13  63.5,52.07 180 top
R14  67.31,15.24 270 top
R15  64.77,15.24 270 top
R16  62.23,15.24 270 top
R17  59.69,15.24 270 top
R18  53.34,64.77 270 top
SV1  43.18,53.85 180 top
U1  39.37,38.1 270 top
U$1  27.18,17.78 0 top
U$2  36.32,17.78 0 top
U$3  45.47,17.78 0 top
U$4  54.61,17.78 0 top
X1  59.69,3.81 180 top
X2  36.83,3.81 180 top
X5  17.78,3.81 0 top
X6  77.47,3.81 0 top
X8  90.17,25.4 90 top
X9  90.17,15.24 90 top

### Tracks (layer width: path | path; a pad name or v marks a point on that pad's centre or on a via)
+5V  (via drill 0.35)  (4 unrouted)
  Top 0.305: C13.1 38.37,28.09 U1.61 38.37,36.59 40.77,38.99 | U1.10 40.89,46.12 | C7.1 41.66,47.92 41.66,47.72 40.91,46.98 40.91,46.15 40.89,46.12 | R1.1 29.3,42.65 C14.1 29.3,42.33 30.03,41.6 U1.31 38.16,41.6 40.77,38.99 | C15.1 50.14,34.1 U1.80 45.66,34.1 40.77,38.99 | 40.77,38.99 40.89,39.12 | 40.89,39.12 40.89,46.12 | U1.100 U1.98 44.88,43.1 40.89,39.12
  Top 0.61: LED1.C 55.12,54.89 55.12,52.16 C12.1 53.12,50.16 IC2.1 43.9,50.16 C7.1 | C8.1 23.53,17.02 28.96,17.02 | 56.39,16.76 56.13,17.02 50.04,17.02 | 56.39,16.76 56.52,16.64 U$4.4 | 28.96,17.02 31.75,17.02 | 31.75,17.02 38.35,17.02 | 38.35,17.02 40.64,17.02 | 40.64,17.02 47.24,17.02 | 47.24,17.02 50.04,17.02 | U$3.4 47.37,16.89 47.24,17.02 | C11.1 50.04,17.02 | C10.1 40.89,16.76 40.64,17.02 | U$2.4 38.23,16.89 38.35,17.02 | C9.1 31.75,17.02 | U$1.4 29.08,16.89 28.96,17.02 | 56.39,16.76 60.68,21.06 IC4.9 61.59,22.48 62.48,23.37 70.36,23.37 80.52,13.21 v85.34,13.21
  Top 0.813: 49.6,58.49 49.6,59.25 v51.05,60.71
  Top 1.016: IC1.2 35.56,61.21 | 35.56,61.21 IC1.TAB 38.3,55.12 SV1.5 | 35.56,61.21 39.2,61.21 C6.1 44.17,63.92 C2.+ 49.6,58.49 51.42,56.67 LED1.C
  Bottom 0.61: v85.34,13.21 86.87,13.21 87.12,13.46
  Bottom 0.813: v51.05,60.71 82.8,60.71 87.12,56.39 87.12,22.86 | 87.12,22.86 87.12,13.46 87.12,12.7 | 87.12,12.7 87.12,11.43 82.8,7.11 82.8,6.86 78.49,6.86 | 78.49,6.86 66.04,6.86 | 66.04,6.86 60.71,6.86 | 60.71,6.86 55.88,6.86 | 55.88,6.86 52.58,6.86 50.8,5.08 X1.8 50.8,3.3 | X1.6 55.88,6.86 | X1.4 60.96,6.6 60.71,6.86 | X1.2 66.04,6.86 | X6.3 78.74,6.6 78.49,6.86 | X9.1 87.12,12.7 | X8.1 87.12,22.86
+12V  (via drill 0.35)  (1 unrouted)
  Top 0.61: v7.87,45.21 D3.C | v7.87,36.32 D4.C | v7.87,27.18 D5.C | v7.87,18.54 D6.C
  Top 1.016: J2.1 13.97,58.76 D1.A 10.67,58.42 7.87,55.63 v7.87,54.1 7.87,52.83
  Bottom 0.61: J2.1 13.97,61.72 7.87,55.63 v7.87,54.1 v7.87,45.21 v7.87,36.32 v7.87,27.18 v7.87,18.54
GND  (via drill 0.35)  (21 unrouted)
  Top 0.305: U1.32 28.5,41.1 27.6,42 C14.2 26.84,43.18 v26.42,43.18 | U1.62 38.87,29.2 39.37,28.7 39.62,28.7 40.22,28.11 C13.2 v41.4,27.94 | U1.11 40.37,48.19 C7.2 40.3,49.19 v40.39,49.28 | U1.81 51.34,34.6 C15.2 52.16,33.11 v51.56,32.51 | IC4.8 60.48,27.2 v60.45,27.18 | C11.2 v50.04,12.95 | C10.2 v40.89,12.95 | C9.2 v31.75,12.95 | U$1.1 25.27,13.08 v25.15,12.95 | IC2.4 52.81,45.24 v52.83,45.21
  Top 0.61: Q6.1 17.21,14.61 R11.2 | Q5.1 17.21,23.5 R9.2 | Q4.1 17.21,32.38 R7.2 | Q3.1 17.21,41.27 R5.2 | Q2.1 17.21,50.16 R3.2 | 55.93,63.48 55.93,56.08 56.73,55.28 C12.2 56.73,48.86 54.23,46.35 IC2.4 | C4.2 C3.2 | C8.2 24.48,14.39 U$1.1 | C9.2 33.63,14.39 U$2.1 | C10.2 42.77,14.39 U$3.1 | C11.2 51.91,14.39 U$4.1 | X8.3 86.11,27.94 v84.84,26.67 | X9.3 86.36,17.78 v85.34,16.76 | X6.4 81.28,7.37 v79.76,8.89
  Top 1.016: 17.21,50.16 17.21,47.95 16.76,47.5 5.08,47.5 | 4.83,47.24 5.08,47.5 | 17.21,41.27 17.21,39.05 17.02,38.86 5.08,38.86 | 5.08,38.86 4.83,39.12 | 17.21,32.38 17.21,30.42 16.76,29.97 5.59,29.97 5.08,29.46 | 17.21,23.5 17.21,21.14 17.27,21.08 5.08,21.08 | R11.2 17.27,14.67 17.27,11.94 5.08,11.94 5.08,21.08 | 5.08,21.08 5.08,29.46 | 5.08,29.46 5.08,38.86 | 5.08,38.86 5.08,47.5 | 5.08,47.5 5.08,55.63 11.43,61.98 11.43,67.05 17.53,67.05 | 17.53,67.05 25.65,67.05 | J2.2 17.47,66.99 17.53,67.05 | C1.- 26.55,67.05 30.48,67.05 | 30.48,67.05 37.59,67.05 | 37.59,67.05 41.66,67.05 | 41.66,67.05 47.24,67.05 47.24,66.15 C2.- 48.14,67.05 53.09,67.05 | C6.2 41.91,66.79 41.66,67.05 | C5.2 30.48,67.05 | IC1.1 37.87,66.77 37.59,67.05 | 53.09,67.05 53.34,66.79 R18.1 | 53.09,67.05 54.62,67.05 55.93,65.73 55.93,63.48 58.17,61.24 58.17,61.21 60.96,58.42 J1.7 J1.1
  Bottom 0.305: v26.42,43.18 26.42,42.67 | v60.45,27.18 60.45,27.69 | v50.04,12.95 50.55,12.95 | v40.89,12.95 41.66,12.95 | v31.75,12.95 32.51,12.95 | v25.15,12.95 24.64,12.95 | v51.56,32.51 52.32,32.51 | v52.83,45.21 53.59,45.21 | v41.4,27.94 42.16,27.94 | v40.39,49.28 41.4,49.28
  Bottom 0.61: v84.84,26.67 83.57,26.67 | v85.34,16.76 84.07,16.76 83.82,17.02 | v79.76,8.89 79.76,9.65
  pour Bottom (isolate 0.254): 0.25,68.58 93.47,68.58 93.47,0 0,0 0,68.58
N$2
  Top 0.61: Q2.4 17.21,53.98 R2.2
N$3
  Top 0.61: R14.2 67.31,8.89 68.58,7.62 X1.1
N$4
  Top 0.61: U$1.2 26.54,8 27.94,6.6 X2.8
N$5
  Top 0.61: U$1.3 27.81,8.51 30.48,5.84 X2.7
N$6
  Top 0.61: U$2.2 35.69,9.02 33.02,6.35 X2.6
N$7
  Top 0.61: X2.5 35.56,6.6 36.58,7.62 36.83,7.87 36.96,8 U$2.3
N$8
  Top 0.61: X2.4 38.1,5.33 44.83,12.06 U$3.2
N$9
  Top 0.61: U$3.3 46.1,11.56 40.64,6.1 X2.3
N$10
  Top 0.61: U$4.2 53.98,13.84 47.75,7.62 44.96,7.62 43.18,5.84 X2.2
N$11
  Top 0.61: X2.1 45.72,5.33 46.99,6.6 48.26,6.6 55.24,13.59 U$4.3
N$12
  Top 0.61: X1.3 63.5,7.37 64.77,8.64 R15.2
N$13
  Top 0.61: X1.5 58.42,7.62 62.23,11.43 R16.2
N$14
  Top 0.61: X1.7 53.34,6.1 59.69,12.45 R17.2
N$18
  Top 1.016: D1.C 22.72,58.42 C1.+ 25.79,61.1 28.61,63.92 C5.1 33.11,63.92 IC1.3
N$19
  Top 0.305: U1.33 27.47,40.6 25.65,42.42 25.65,47.5 28.45,50.29 Q1.2
  Top 0.61: Q1.2 32.09,51.14 C3.1
N$20
  Top 0.305: U1.34 27.21,40.1 25.15,42.16 25.15,49.28 Q1.1
  Top 0.61: Q1.1 24.55,51.9 C4.1
N$21
  Top 0.61: IC4.14 67.94,17.91 73.66,12.19 X6.1
N$22  (1 unrouted)
  Top 0.61: D2.A 11.06,49.9 11.18,49.78 11.45,50.05 Q2.MB
  Bottom 1.27: X5.5 22.86,44.45 15.49,51.82 11.43,51.82
N$23
  Top 0.61: Q3.4 17.21,45.09 R4.2
N$24
  Top 0.61: IC4.15 69.22,18.16 76.2,11.18 X6.2
N$25  (1 unrouted)
  Top 0.61: D3.A 11.04,41.01 11.45,41.42 Q3.MB
  Bottom 1.27: X5.4 20.32,34.04 11.43,42.93
N$26
  Top 0.61: Q4.4 17.21,36.2 R6.2
N$27  (1 unrouted)
  Top 0.406: IC2.7 62.36,48.9 65.02,51.56 | J1.6 64.26,54.48 64.26,52.71 R13.1
N$28  (1 unrouted)
  Top 0.61: D4.A 11.04,32.12 11.45,32.53 Q4.MB
  Bottom 1.27: X5.3 17.78,27.94 11.43,34.29
N$29
  Top 0.61: Q5.4 17.21,27.3 R8.2
N$30
  Top 0.61: IC4.13 66.67,17.65 67.31,17.02 R14.1
N$31  (1 unrouted)
  Top 0.61: D5.A 11.04,23.23 11.45,23.64 Q5.MB
  Bottom 1.27: X5.2 15.24,21.59 11.43,25.4
N$32
  Top 0.61: Q6.4 17.21,18.41 R10.2
N$33  (1 unrouted)
  Top 0.406: IC2.6 64.39,47.62 64.52,47.5 64.52,47.75 66.55,49.78 66.55,54.74 J1.4
N$34  (1 unrouted)
  Top 0.61: D6.A 11.06,14.34 11.18,14.22 11.45,14.49 Q6.MB
  Bottom 1.27: X5.1 12.7,14.73 11.18,16.26
N$35  (1 unrouted)
  Top 0.406: IC2.5 60.6,44.7 66.29,44.7 67.56,45.97 67.56,46.23 | J1.2 67.94,47.49 R12.2
N$36
  Top 0.406: J1.8 60.33,53.84 61.91,52.26 61.98,52.19 | 61.98,52.19 R13.2 | IC2.8 60.83,50.16 61.98,51.31 61.98,52.19
N$38
  Top 0.61: IC4.12 65.41,19.43 64.77,18.8 R15.1
N$39
  Top 0.61: IC4.11 64.14,19.68 62.23,17.78 R16.1
N$40
  Top 0.61: IC4.10 62.87,19.94 59.69,16.76 R17.1
N$41
  Top 1.016: LED1.A R18.2
PA0
  Top 0.305: U1.78 48.69,33.1 51.56,30.23 64.52,30.23 66.67,28.07 IC4.4
PA1
  Top 0.305: IC4.5 65.41,28.07 63.75,29.72 51.31,29.72 48.43,32.6 U1.77
PA2
  Top 0.305: IC4.6 64.14,28.07 62.99,29.21 51.05,29.21 48.16,32.1 U1.76
PA3
  Top 0.305: IC4.7 62.87,28.07 62.23,28.7 46.77,28.7 U1.75
PB1(SCK)  (via drill 0.35)  (1 unrouted)
  Top 0.305: U1.20 35.87,48.57 38.1,50.8 41.66,50.8 43.18,52.32 SV1.4 | U$1.5 29.08,19.43 29.72,18.8 33.02,18.8 v33.27,19.05 | U$2.5 39.37,19.24 v39.37,19.05 v42.42,19.05 | U$3.5 47.37,20.19 v48.51,19.05 v51.56,19.05 | v56.39,18.54 56.52,18.67 U$4.5
  Bottom 0.305: v33.27,19.05 v39.37,19.05 | v42.42,19.05 v48.51,19.05 | v51.56,19.05 55.88,19.05 v56.39,18.54
PB2(MOSI)
  Top 0.305: U1.21 35.37,48.83 37.85,51.31 41.4,51.31 41.91,51.82 41.91,53.85 SV1.3
PB3(MISO)  (1 unrouted)
  Top 0.305: U1.22 34.87,49.09 38.35,52.58 SV1.6
  Top 0.61: U$1.7 26.54,18.92 27.43,18.03 35.56,18.03 | 35.56,18.03 44.96,18.03 | 44.96,18.03 53.09,18.03 53.98,18.92 U$4.7 | U$3.7 44.83,18.16 44.96,18.03 | U$2.7 35.69,18.16 35.56,18.03
PC0
  Top 0.305: U1.53 34.37,24.72 32,22.35 28.7,22.35 27.69,21.34 27.81,21.21 U$1.6
PC1
  Top 0.305: U1.54 34.87,24.57 36.96,22.48 U$2.6
PC2
  Top 0.305: U1.55 35.37,24.83 37.34,22.86 44.96,22.86 46.1,21.72 U$3.6
PC3
  Top 0.305: U1.56 35.87,25.09 37.59,23.37 53.34,23.37 55.24,21.46 U$4.6
PD0  (via drill 0.35)
  Top 0.305: X9.2 79.5,15.24 70.1,24.64 38.1,24.64 v36.83,25.91 | U1.43 31.33,35.56 30.34,35.56 29.52,34.73 29.52,30.43 v33.27,26.67
  Bottom 0.305: v36.83,25.91 36.27,26.47 33.85,26.47 33.64,26.67 v33.27,26.67
PD1  (via drill 0.35)
  Top 0.305: X8.2 38.61,25.4 v37.08,26.92 | v33.27,27.69 29.97,30.99 29.97,34.54 30.53,35.1 U1.44
  Bottom 0.305: v37.08,26.92 34.04,26.92 v33.27,27.69
PH0  (via drill 0.35)
  Top 0.305: IC2.2 44.07,48.9 v43.94,48.77 | v39.12,49.02 39.44,48.7 39.44,47.63 39.87,47.21 U1.12
  Bottom 0.305: v43.94,48.77 41.4,48.77 40.89,48.26 39.88,48.26 v39.12,49.02
PH1  (via drill 0.35)
  Top 0.305: IC2.3 43.56,47.62 v43.43,47.75 | v38.1,48.51 38.1,48.26 39.37,46.99 U1.13
  Bottom 0.305: v38.1,48.51 38.66,48.51 39.37,47.8 43.38,47.8 v43.43,47.75
PJ7
  Top 0.305: U1.79 48.95,33.6 51.82,30.73 65.02,30.73 67.94,27.81 IC4.3
PL0
  Top 0.305: 20.03,50.51 24.64,45.91 24.64,41.91 26.95,39.6 U1.35
  Top 0.61: R2.1 R3.1 20.03,50.51
PL1
  Top 0.305: U1.36 26.69,39.1 21.34,44.45 R4.1
  Top 0.61: R4.1 R5.1
PL2
  Top 0.305: U1.37 22.79,38.6 R6.1
  Top 0.61: R6.1 R7.1
PL6
  Top 0.305: U1.41 22.63,36.6 21.08,35.05 21.08,28.45 19.75,27.11 R8.1
  Top 0.61: R8.1 R9.1
PL7
  Top 0.305: U1.42 22.89,36.1 21.59,34.8 21.59,28.19 21.08,27.69 21.08,19.12 R10.1
  Top 0.61: R10.1 R11.1
RESET  (via drill 0.35)
  Top 0.305: U1.30 30.54,42.1 30.32,42.32 30.32,42.33 30.23,42.42 30.23,43.18 29.14,44.26 R1.2 29.14,45.4 v30.23,46.48 | SV1.2 44.96,52.58 42.42,50.04 38.35,50.04 36.83,48.51 v36.83,48.01
  Bottom 0.305: v36.83,48.01 36.58,47.75 33.02,47.75 31.75,46.48 v30.23,46.48

### Text on the board
tNames: Extruder | Controller | v1 | Hopper level | GND | 5V | Screw RPM | GND | 5V | Heaters | Motor | Fans | Thermocouples | F1- | F2- | F3- | F4- | F5- | T1+ | T1- | T2+ | T2- | T3+ | T3- | T4+ | T4- | 5V | SSR1 | 5V | SSR2 | 5V | SSR3 | 5V | SSR4 | DIR | STEP | 5V | GND